# EAGLE schematic Cap Piano Circuit (EAGLE 9.6.2)
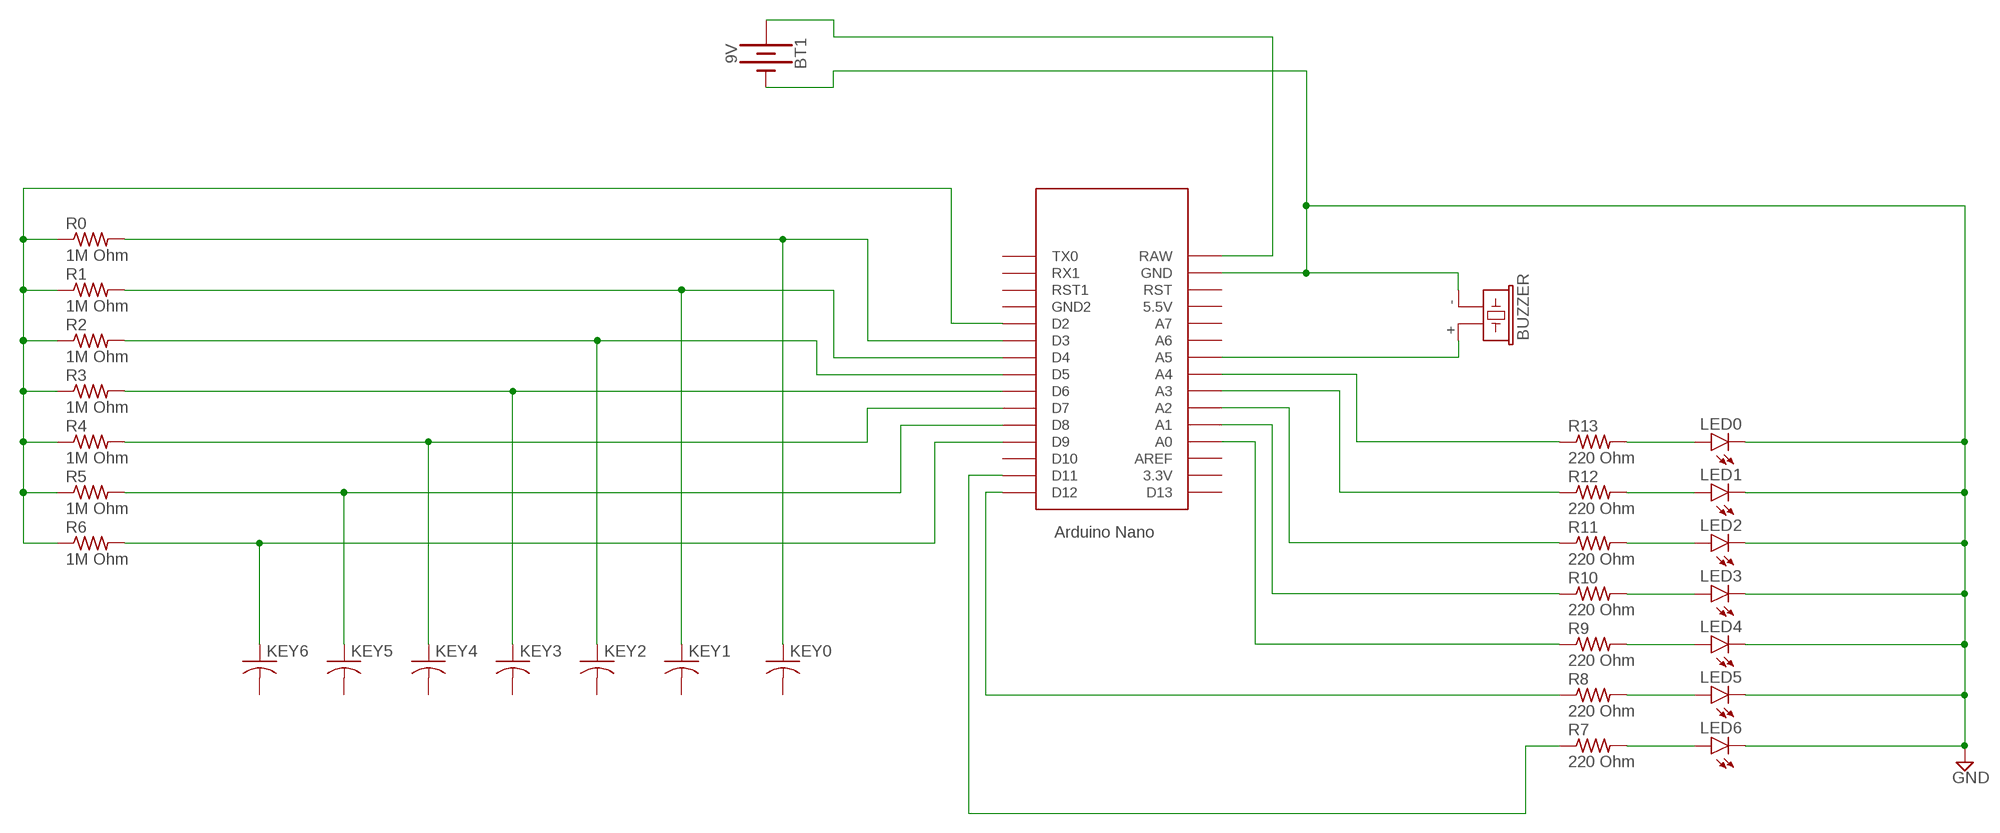
[diagram p0: schematic, sheet 1]

## Parts
BT1  9V  BATTERY-9V  [BATTCON_9V]
BUZZER  F/CM12P  [F/CM12P]
KEY0  C-US050-024X044  [C050-024X044]
KEY1  C-US050-024X044  [C050-024X044]
KEY2  C-US050-024X044  [C050-024X044]
KEY3  C-US050-024X044  [C050-024X044]
KEY4  C-US050-024X044  [C050-024X044]
KEY5  C-US050-024X044  [C050-024X044]
KEY6  C-US050-024X044  [C050-024X044]
LED0  LED5MM  [LED5MM]
LED1  LED5MM  [LED5MM]
LED2  LED5MM  [LED5MM]
LED3  LED5MM  [LED5MM]
LED4  LED5MM  [LED5MM]
LED5  LED5MM  [LED5MM]
LED6  LED5MM  [LED5MM]
R0  1M Ohm  R-US_0204/7  [0204/7]
R1  1M Ohm  R-US_0204/7  [0204/7]
R2  1M Ohm  R-US_0204/7  [0204/7]
R3  1M Ohm  R-US_0204/7  [0204/7]
R4  1M Ohm  R-US_0204/7  [0204/7]
R5  1M Ohm  R-US_0204/7  [0204/7]
R6  1M Ohm  R-US_0204/7  [0204/7]
R7  220 Ohm  R-US_0204/7  [0204/7]
R8  220 Ohm  R-US_0204/7  [0204/7]
R9  220 Ohm  R-US_0204/7  [0204/7]
R10  220 Ohm  R-US_0204/7  [0204/7]
R11  220 Ohm  R-US_0204/7  [0204/7]
R12  220 Ohm  R-US_0204/7  [0204/7]
R13  220 Ohm  R-US_0204/7  [0204/7]
U$1  NANO  [NANO]

## Nets
GND: BT1.- BUZZER.- LED0.K(C) LED1.K(C) LED2.K(C) LED3.K(C) LED4.K(C) LED5.K(C) LED6.K(C) U$1.GND
N$1: BUZZER.+ U$1.A5
N$2: BT1.+ U$1.RAW
N$5: R0.1 R1.1 R2.1 R3.1 R4.1 R5.1 R6.1 U$1.D2
N$7: KEY0.1 R0.2 U$1.D3
N$8: KEY1.1 R1.2 U$1.D4
N$9: KEY2.1 R2.2 U$1.D5
N$10: KEY3.1 R3.2 U$1.D6
N$11: KEY4.1 R4.2 U$1.D7
N$12: KEY5.1 R5.2 U$1.D8
N$13: KEY6.1 R6.2 U$1.D9
N$14: R7.1 U$1.D11
N$15: R8.1 U$1.D12
N$16: R9.1 U$1.A0
N$17: R10.1 U$1.A1
N$18: R11.1 U$1.A2
N$19: R12.1 U$1.A3
N$20: R13.1 U$1.A4
N$22: LED0.A R13.2
N$23: LED1.A R12.2
N$24: LED2.A R11.2
N$25: LED3.A R10.2
N$26: LED4.A R9.2
N$27: LED5.A R8.2
N$28: LED6.A R7.2
Unconnected: KEY0.2 KEY1.2 KEY2.2 KEY3.2 KEY4.2 KEY5.2 KEY6.2 U$1.3.3V U$1.5V(5.5V) U$1.A6 U$1.A7 U$1.AREF U$1.D10 U$1.D13 U$1.GND1(GND2) U$1.ICSP1 U$1.ICSP2 U$1.ICSP3 U$1.ICSP4 U$1.ICSP5 U$1.ICSP6 U$1.RST U$1.RST1 U$1.RX1 U$1.TX0

## Library data of the parts
BT1 = SparkFun-Batteries:BATTERY: Battery - Single Cell A variety of battery chemistries, sizes, and footprints. Device List: 20MM_PTH - Coin Cell Battery Holder - 20mm (PTH) <https://www.sparkfun.com/products/783> 6.8MM_PTH - Coin Cell Battery Holder - 6.8MM(SMD) <https://www.digikey.com/product-detail/en/seiko-instruments/MS621FE-FL11E/728-1057-ND/1889208?WT.srch=1&gclid=CNOQ5a6LzdQCFZS2wAodXCkE0g> 12MM_SMD - Coin Cell Battery Holder - 12mm (SMD) <https://www.sparkfun.com/products/10592> 12MM_PTH - Coin Cell Battery Holder - 12mm (PTH) <https://www.sparkfun.com/products/7948> 20MM_SMD - 20mm Coin Cell Battery Holder (SMD) (2 legs) Used on the Big Time Watch Kit <https://www.sparkfun.com/products/11734> 20MM_SMD_4LEGS - Coin Cell Battery Holder - 20mm (SMD) <https://www.sparkfun.com/products/11892> 20MM_SMD_4LEGS_OVERPASTE - Coin Cell Battery Holder - 20mm (SMD) <https://www.sparkfun.com/products/11892> (Over-paste on the legs) 24.5MM_PTH - Coin Cell Battery Holder - 24.5mm (PTH) <https://www.sparkfun.com/products/8863> 9V - 9V Battery Holder - PC Mount Used on the SparkFun SparkPunk Sound Kit <https://www.sparkfun.com/products/11177> and SparkFun SparkPunk Sequencer Kit <https://www.sparkfun.com/products/12707> 18650 - Battery Holder - 18650 (PTH) <https://www.sparkfun.com/products/13113> AA - Battery Holder - 1xAA (PTH) <https://www.sparkfun.com/products/7949> AAA - Battery Holder - 1xAAA (PTH) <https://www.sparkfun.com/products/12718> AA_KIT - Battery Holder - 1xAA (PTH) <https://www.sparkfun.com/products/7949> Special kit package - pads only have exposed copper on one side of the board. AAA_KIT - Battery Holder - 1xAAA (PTH) <https://www.sparkfun.com/products/12718> Special kit package - pads only have exposed copper on one side of the board.; PROD_ID: BATT-10855
BUZZER = buzzer:F/CM12P: BUZZER Source: Buerklin; OC_FARNELL: unknown; OC_NEWARK: unknown
KEY0 KEY1-KEY6 = rcl:C-US: CAPACITOR, American symbol; SPICEPREFIX: C
LED0 LED1-LED6 = led:LED: LED OSRAM: - CHIPLED LG R971, LG N971, LY N971, LG Q971, LY Q971, LO R971, LY R971 LH N974, LH R974 LS Q976, LO Q976, LY Q976 LO Q996 - Hyper CHIPLED LW Q18S LB Q993, LB Q99A, LB R99A - SideLED LS A670, LO A670, LY A670, LG A670, LP A670 LB A673, LV A673, LT A673, LW A673 LH A674 LY A675 LS A676, LA A676, LO A676, LY A676, LW A676 LS A679, LY A679, LG A679 - Hyper Micro SIDELED® LS Y876, LA Y876, LO Y876, LY Y876 LT Y87S - SmartLED LW L88C, LW L88S LB L89C, LB L89S, LG L890 LS L89K, LO L89K, LY L89K LS L896, LA L896, LO L896, LY L896 - TOPLED LS T670, LO T670, LY T670, LG T670, LP T670 LSG T670, LSP T670, LSY T670, LOP T670, LYG T670 LG T671, LOG T671, LSG T671 LB T673, LV T673, LT T673, LW T673 LH T674 LS T676, LA T676, LO T676, LY T676, LB T676, LH T676, LSB T676, LW T676 LB T67C, LV T67C, LT T67C, LS T67K, LO T67K, LY T67K, LW E67C LS E67B, LA E67B, LO E67B, LY E67B, LB E67C, LV E67C, LT E67C LW T67C LS T679, LY T679, LG T679 LS T770, LO T770, LY T770, LG T770, LP T770 LB T773, LV T773, LT T773, LW T773 LH T774 LS E675, LA E675, LY E675, LS T675 LS T776, LA T776, LO T776, LY T776, LB T776 LHGB T686 LT T68C, LB T68C - Hyper Mini TOPLED® LB M676 - Mini TOPLED Santana® LG M470 LS M47K, LO M47K, LY M47K Source: http://www.osram.convergy.de LUXEON: - LUMILED® LXK2-PW12-R00, LXK2-PW12-S00, LXK2-PW14-U00, LXK2-PW14-V00 LXK2-PM12-R00, LXK2-PM12-S00, LXK2-PM14-U00 LXK2-PE12-Q00, LXK2-PE12-R00, LXK2-PE12-S00, LXK2-PE14-T00, LXK2-PE14-U00 LXK2-PB12-K00, LXK2-PB12-L00, LXK2-PB12-M00, LXK2-PB14-N00, LXK2-PB14-P00, LXK2-PB14-Q00 LXK2-PR12-L00, LXK2-PR12-M00, LXK2-PR14-Q00, LXK2-PR14-R00 LXK2-PD12-Q00, LXK2-PD12-R00, LXK2-PD12-S00 LXK2-PH12-R00, LXK2-PH12-S00 LXK2-PL12-P00, LXK2-PL12-Q00, LXK2-PL12-R00 Source: www.luxeon.com KINGBRIGHT: KA-3528ASYC Source: www.kingbright.com
R0 R1-R13 = rcl:R-US_: RESISTOR, American symbol; SPICEPREFIX: R
U$1 = Arduino-clone:NANO: Arduino Nano